# EAGLE design IAS_v006 (EAGLE 7.3.0)
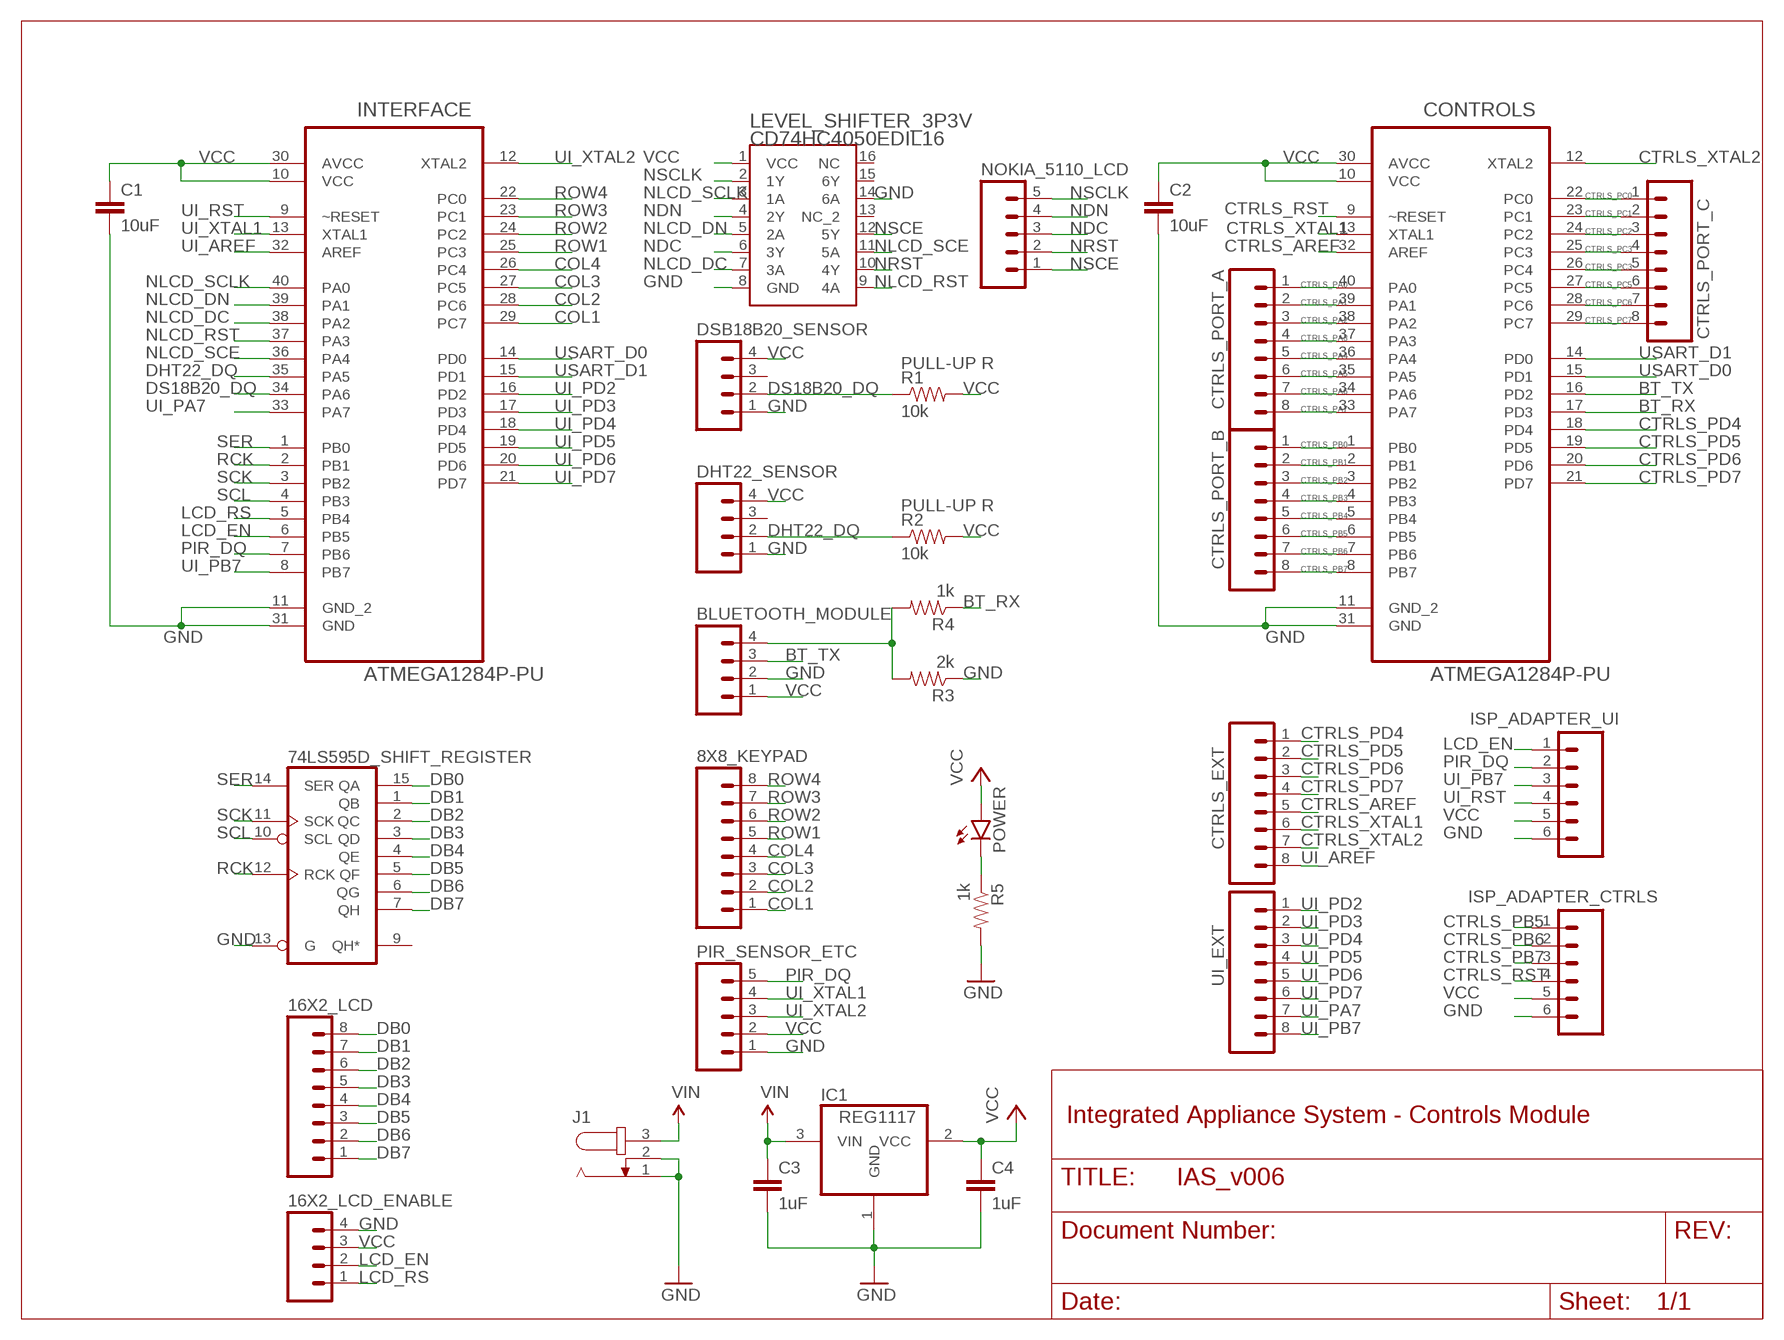
[diagram p0: schematic, sheet 1]

## Parts
8X8_KEYPAD  M08  [1X08_ROUND]
16X2_LCD  M08  [1X08_ROUND]
16X2_LCD_ENABLE  M04NO_SILK_ALL_ROUND  [1X04_NO_SILK_ALL_ROUND]
74LS595D_SHIFT_REGISTER  74LS595N  [DIL16]
BLUETOOTH_MODULE  M04NO_SILK_ALL_ROUND  [1X04_NO_SILK_ALL_ROUND]
C1  10uF  CAP1206  [1206]
C2  10uF  CAP1206  [1206]
C3  1uF  CAP1206  [1206]
C4  1uF  CAP1206  [1206]
CONTROLS  ATMEGA1284P-PU  [DIP254P1524X483-40]
CTRLS_EXT  M08  [1X08_ROUND]
CTRLS_PORT_A  M08  [1X08_ROUND]
CTRLS_PORT_B  M08  [1X08_ROUND]
CTRLS_PORT_C  M08  [1X08_ROUND]
DHT22_SENSOR  M04NO_SILK_ALL_ROUND  [1X04_NO_SILK_ALL_ROUND]
DSB18B20_SENSOR  M04NO_SILK_ALL_ROUND  [1X04_NO_SILK_ALL_ROUND]
IC1  REG1117  [SOT223]
INTERFACE  ATMEGA1284P-PU  [DIP254P1524X483-40]
ISP_ADAPTER_CTRLS  M06SILK_FEMALE_PTH  [1X06]
ISP_ADAPTER_UI  M06SILK_FEMALE_PTH  [1X06]
J1  JACK-PLUG0  [SPC4077]
LEVEL_SHIFTER_3P3V  CD74HC4050EDIL16  [DIL16]
NOKIA_5110_LCD  M05PTH  [1X05]
PIR_SENSOR_ETC  M05PTH  [1X05]
POWER  LED3MM  [LED3MM]
R1  10k  RESISTOR1206  [1206]
R2  10k  RESISTOR1206  [1206]
R3  2k  RESISTOR1206  [1206]
R4  1k  RESISTOR1206  [1206]
R5  1k  RESISTOR1206  [1206]
UI_EXT  M08  [1X08_ROUND]

## Nets
BT_RX: CONTROLS.17(PD3) R4.1
BT_TX: BLUETOOTH_MODULE.3 CONTROLS.16(PD2)
COL1: 8X8_KEYPAD.1 INTERFACE.29(PC7)
COL2: 8X8_KEYPAD.2 INTERFACE.28(PC6)
COL3: 8X8_KEYPAD.3 INTERFACE.27(PC5)
COL4: 8X8_KEYPAD.4 INTERFACE.26(PC4)
CTRLS_AREF: CONTROLS.32(AREF) CTRLS_EXT.5
CTRLS_PA0: CONTROLS.40(PA0) CTRLS_PORT_A.1
CTRLS_PA1: CONTROLS.39(PA1) CTRLS_PORT_A.2
CTRLS_PA2: CONTROLS.38(PA2) CTRLS_PORT_A.3
CTRLS_PA3: CONTROLS.37(PA3) CTRLS_PORT_A.4
CTRLS_PA4: CONTROLS.36(PA4) CTRLS_PORT_A.5
CTRLS_PA5: CONTROLS.35(PA5) CTRLS_PORT_A.6
CTRLS_PA6: CONTROLS.34(PA6) CTRLS_PORT_A.7
CTRLS_PA7: CONTROLS.33(PA7) CTRLS_PORT_A.8
CTRLS_PB0: CONTROLS.1(PB0) CTRLS_PORT_B.1
CTRLS_PB1: CONTROLS.2(PB1) CTRLS_PORT_B.2
CTRLS_PB2: CONTROLS.3(PB2) CTRLS_PORT_B.3
CTRLS_PB3: CONTROLS.4(PB3) CTRLS_PORT_B.4
CTRLS_PB4: CONTROLS.5(PB4) CTRLS_PORT_B.5
CTRLS_PB5: CONTROLS.6(PB5) CTRLS_PORT_B.6 ISP_ADAPTER_CTRLS.1
CTRLS_PB6: CONTROLS.7(PB6) CTRLS_PORT_B.7 ISP_ADAPTER_CTRLS.2
CTRLS_PB7: CONTROLS.8(PB7) CTRLS_PORT_B.8 ISP_ADAPTER_CTRLS.3
CTRLS_PC0: CONTROLS.22(PC0) CTRLS_PORT_C.1
CTRLS_PC1: CONTROLS.23(PC1) CTRLS_PORT_C.2
CTRLS_PC2: CONTROLS.24(PC2) CTRLS_PORT_C.3
CTRLS_PC3: CONTROLS.25(PC3) CTRLS_PORT_C.4
CTRLS_PC4: CONTROLS.26(PC4) CTRLS_PORT_C.5
CTRLS_PC5: CONTROLS.27(PC5) CTRLS_PORT_C.6
CTRLS_PC6: CONTROLS.28(PC6) CTRLS_PORT_C.7
CTRLS_PC7: CONTROLS.29(PC7) CTRLS_PORT_C.8
CTRLS_PD4: CONTROLS.18(PD4) CTRLS_EXT.1
CTRLS_PD5: CONTROLS.19(PD5) CTRLS_EXT.2
CTRLS_PD6: CONTROLS.20(PD6) CTRLS_EXT.3
CTRLS_PD7: CONTROLS.21(PD7) CTRLS_EXT.4
CTRLS_RST: CONTROLS.9(~RESET) ISP_ADAPTER_CTRLS.4
CTRLS_XTAL1: CONTROLS.13(XTAL1) CTRLS_EXT.6
CTRLS_XTAL2: CONTROLS.12(XTAL2) CTRLS_EXT.7
DB0: 16X2_LCD.8 74LS595D_SHIFT_REGISTER.15(QA)
DB1: 16X2_LCD.7 74LS595D_SHIFT_REGISTER.1(QB)
DB2: 16X2_LCD.6 74LS595D_SHIFT_REGISTER.2(QC)
DB3: 16X2_LCD.5 74LS595D_SHIFT_REGISTER.3(QD)
DB4: 16X2_LCD.4 74LS595D_SHIFT_REGISTER.4(QE)
DB5: 16X2_LCD.3 74LS595D_SHIFT_REGISTER.5(QF)
DB6: 16X2_LCD.2 74LS595D_SHIFT_REGISTER.6(QG)
DB7: 16X2_LCD.1 74LS595D_SHIFT_REGISTER.7(QH)
DHT22_DQ: DHT22_SENSOR.2 INTERFACE.35(PA5) R2.1
DS18B20_DQ: DSB18B20_SENSOR.2 INTERFACE.34(PA6) R1.1
GND: 16X2_LCD_ENABLE.4 74LS595D_SHIFT_REGISTER.13(G) BLUETOOTH_MODULE.2 C1.2 C2.2 C3.2 C4.2 CONTROLS.11(GND_2) CONTROLS.31(GND) DHT22_SENSOR.1 DSB18B20_SENSOR.1 IC1.1(GND) INTERFACE.11(GND_2) INTERFACE.31(GND) ISP_ADAPTER_CTRLS.6 ISP_ADAPTER_UI.6 J1.1 J1.2 LEVEL_SHIFTER_3P3V.8(GND) LEVEL_SHIFTER_3P3V.14(6A) PIR_SENSOR_ETC.1 R3.1 R5.2
LCD_EN: 16X2_LCD_ENABLE.2 INTERFACE.6(PB5) ISP_ADAPTER_UI.1
LCD_RS: 16X2_LCD_ENABLE.1 INTERFACE.5(PB4)
N$2: POWER.K(C) R5.1
N$7: BLUETOOTH_MODULE.4 R3.2 R4.2
NDC: LEVEL_SHIFTER_3P3V.6(3Y) NOKIA_5110_LCD.3
NDN: LEVEL_SHIFTER_3P3V.4(2Y) NOKIA_5110_LCD.4
NLCD_DC: INTERFACE.38(PA2) LEVEL_SHIFTER_3P3V.7(3A)
NLCD_DN: INTERFACE.39(PA1) LEVEL_SHIFTER_3P3V.5(2A)
NLCD_RST: INTERFACE.37(PA3) LEVEL_SHIFTER_3P3V.9(4A)
NLCD_SCE: INTERFACE.36(PA4) LEVEL_SHIFTER_3P3V.11(5A)
NLCD_SCLK: INTERFACE.40(PA0) LEVEL_SHIFTER_3P3V.3(1A)
NRST: LEVEL_SHIFTER_3P3V.10(4Y) NOKIA_5110_LCD.2
NSCE: LEVEL_SHIFTER_3P3V.12(5Y) NOKIA_5110_LCD.1
NSCLK: LEVEL_SHIFTER_3P3V.2(1Y) NOKIA_5110_LCD.5
PIR_DQ: INTERFACE.7(PB6) ISP_ADAPTER_UI.2 PIR_SENSOR_ETC.5
RCK: 74LS595D_SHIFT_REGISTER.12(RCK) INTERFACE.2(PB1)
ROW1: 8X8_KEYPAD.5 INTERFACE.25(PC3)
ROW2: 8X8_KEYPAD.6 INTERFACE.24(PC2)
ROW3: 8X8_KEYPAD.7 INTERFACE.23(PC1)
ROW4: 8X8_KEYPAD.8 INTERFACE.22(PC0)
SCK: 74LS595D_SHIFT_REGISTER.11(SCK) INTERFACE.3(PB2)
SCL: 74LS595D_SHIFT_REGISTER.10(SCL) INTERFACE.4(PB3)
SER: 74LS595D_SHIFT_REGISTER.14(SER) INTERFACE.1(PB0)
UI_AREF: CTRLS_EXT.8 INTERFACE.32(AREF)
UI_PA7: INTERFACE.33(PA7) UI_EXT.7
UI_PB7: INTERFACE.8(PB7) ISP_ADAPTER_UI.3 UI_EXT.8
UI_PD2: INTERFACE.16(PD2) UI_EXT.1
UI_PD3: INTERFACE.17(PD3) UI_EXT.2
UI_PD4: INTERFACE.18(PD4) UI_EXT.3
UI_PD5: INTERFACE.19(PD5) UI_EXT.4
UI_PD6: INTERFACE.20(PD6) UI_EXT.5
UI_PD7: INTERFACE.21(PD7) UI_EXT.6
UI_RST: INTERFACE.9(~RESET) ISP_ADAPTER_UI.4
UI_XTAL1: INTERFACE.13(XTAL1) PIR_SENSOR_ETC.4
UI_XTAL2: INTERFACE.12(XTAL2) PIR_SENSOR_ETC.3
USART_D0: CONTROLS.15(PD1) INTERFACE.14(PD0)
USART_D1: CONTROLS.14(PD0) INTERFACE.15(PD1)
VCC: 16X2_LCD_ENABLE.3 BLUETOOTH_MODULE.1 C1.1 C2.1 C4.1 CONTROLS.10(VCC) CONTROLS.30(AVCC) DHT22_SENSOR.4 DSB18B20_SENSOR.4 IC1.2(VCC) INTERFACE.10(VCC) INTERFACE.30(AVCC) ISP_ADAPTER_CTRLS.5 ISP_ADAPTER_UI.5 LEVEL_SHIFTER_3P3V.1(VCC) PIR_SENSOR_ETC.2 POWER.A R1.2 R2.2
VIN: C3.1 IC1.3(VIN) J1.3
Unconnected: 74LS595D_SHIFT_REGISTER.9(QH*) DHT22_SENSOR.3 DSB18B20_SENSOR.3 LEVEL_SHIFTER_3P3V.13(NC_2) LEVEL_SHIFTER_3P3V.15(6Y) LEVEL_SHIFTER_3P3V.16(NC)

## Notes on the sheet
- PULL-UP R
- PULL-UP R
- Integrated Appliance System - Controls Module

## Power pins joined to a net without a drawn wire
GND: 74LS595D_SHIFT_REGISTER.8(GND)
VCC: 74LS595D_SHIFT_REGISTER.16(VCC)

## Library data of the parts
8X8_KEYPAD 16X2_LCD CTRLS_EXT CTRLS_PORT_A CTRLS_PORT_B CTRLS_PORT_C UI_EXT = SparkFun-Connectors:M08: Header 8 Standard 8-pin 0.1" header. Use with straight break away headers (SKU : PRT-00116), right angle break away headers (PRT-00553), swiss pins (PRT-00743), machine pins (PRT-00117), and female headers (PRT-00115).; OC_NEWARK: unknown
16X2_LCD_ENABLE BLUETOOTH_MODULE DHT22_SENSOR DSB18B20_SENSOR = SparkFun-Connectors:M04: Header 4 Standard 4-pin 0.1" header. Use with straight break away headers (SKU : PRT-00116), right angle break away headers (PRT-00553), swiss pins (PRT-00743), machine pins (PRT-00117), and female headers (PRT-00115). Molex polarized connector foot print use with SKU : PRT-08231 with associated crimp pins and housings. 1MM SMD Version SKU: PRT-10208; OC_NEWARK: unknown
74LS595D_SHIFT_REGISTER = 74xx-us:74*595: 8-bit SHIFT REGISTER, output latch; MPN: SN74LS595D; OC_NEWARK: 34R8835
C1-C4 = SparkFun-Capacitors:CAP: Capacitor Standard 0603 ceramic capacitor, and 0.1" leaded capacitor.; OC_NEWARK: unknown
CONTROLS INTERFACE = Atmel_By_element14_Batch_1-00:ATMEGA1284P-PU: 8-bit Microcontroller with In-System Programmable Flash; MPN: ATMEGA1284P-PU; OC_FARNELL: 1715481; OC_NEWARK: 15R0264; PACKAGE: PDIP-40; SUPPLIER: Atmel
IC1 = sergio:REG1117: 800mA and 1A Low Dropout (LDO) Positive Regulator 1.8V, 2.5V, 2.85V, 3.3V, 5V, and Adj; MPN: REG1117; OC_FARNELL: 1097566; OC_NEWARK: 14P6981
ISP_ADAPTER_CTRLS ISP_ADAPTER_UI = SparkFun-Connectors:M06: Header 6 Standard 6-pin 0.1" header. Use with straight break away headers (SKU : PRT-00116), right angle break away headers (PRT-00553), swiss pins (PRT-00743), machine pins (PRT-00117), and female headers (PRT-00115). Molex polarized connector foot print use with SKU : PRT-08094 with associated crimp pins and housings. NOTES ON THE VARIANTS LOCK and LOCK_LONGPADS... This footprint was designed to help hold the alignment of a through-hole component (i.e. 6-pin header) while soldering it into place. You may notice that each hole has been shifted either up or down by 0.005 of an inch from it's more standard position (which is a perfectly straight line). This slight alteration caused the pins (the squares in the middle) to touch the edges of the holes. Because they are alternating, it causes a "brace" to hold the component in place. 0.005 has proven to be the perfect amount of "off-center" position when using our standard breakaway headers. Although looks a little odd when you look at the bare footprint, once you have a header in there, the alteration is very hard to notice. Also,if you push a header all the way into place, it is covered up entirely on the bottom side. This idea of altering the position of holes to aid alignment will be further integrated into the Sparkfun Library for other footprints. It can help hold any component with 3 or more connection pins.; OC_NEWARK: unknown; PROD_ID: CONN-08437
J1 = con-jack:JACK-PLUG: DC POWER JACK Power Jack, DC, Right Angle, Through Hole, Rated 5A at 16VDC, PC Terminals Distributor: Farnell (www.Farnell.de) Drawing: 84N1161.pdf / 84N1162.pdf Manufacturer: SPC Technology (www.spctechnology.com) Type: SPC4077 / SPC 4078; OC_FARNELL: unknown; OC_NEWARK: unknown
LEVEL_SHIFTER_3P3V = IAS:CD74HC4050E: Non-inverting hex buffer.; COPYRIGHT: Copyright (C) 2015 Accelerated Designs. All rights reserved; FAMILY: Buffer and Line Driver; MANUFACTURER_NAME: Texas Instruments; MANUFACTURER_PART_NUMBER: CD74HC4050EE4; RSPARTNUMBER: 7092573; SECTION: Standard and Speciality Logic; VENDOR: Texas Instruments
NOKIA_5110_LCD PIR_SENSOR_ETC = SparkFun-Connectors:M05: Header 5 Standard 5-pin 0.1" header. Use with straight break away headers (SKU : PRT-00116), right angle break away headers (PRT-00553), swiss pins (PRT-00743), machine pins (PRT-00117), and female headers (PRT-00115). Molex polarized connector foot print use with SKU : PRT-08230 with associated crimp pins and housings.; OC_NEWARK: unknown
POWER = SparkFun-LED:LED: LEDs Standard schematic elements and footprints for 5mm, 3mm, 1206, and 0603 sized LEDs. 5mm - Spark Fun Electronics SKU : COM-00529 (and others)
R1-R5 = SparkFun-Resistors:RESISTOR: Resistor Basic schematic elements and footprints for 0603, 1206, and PTH resistors.; OC_NEWARK: unknown

## Board
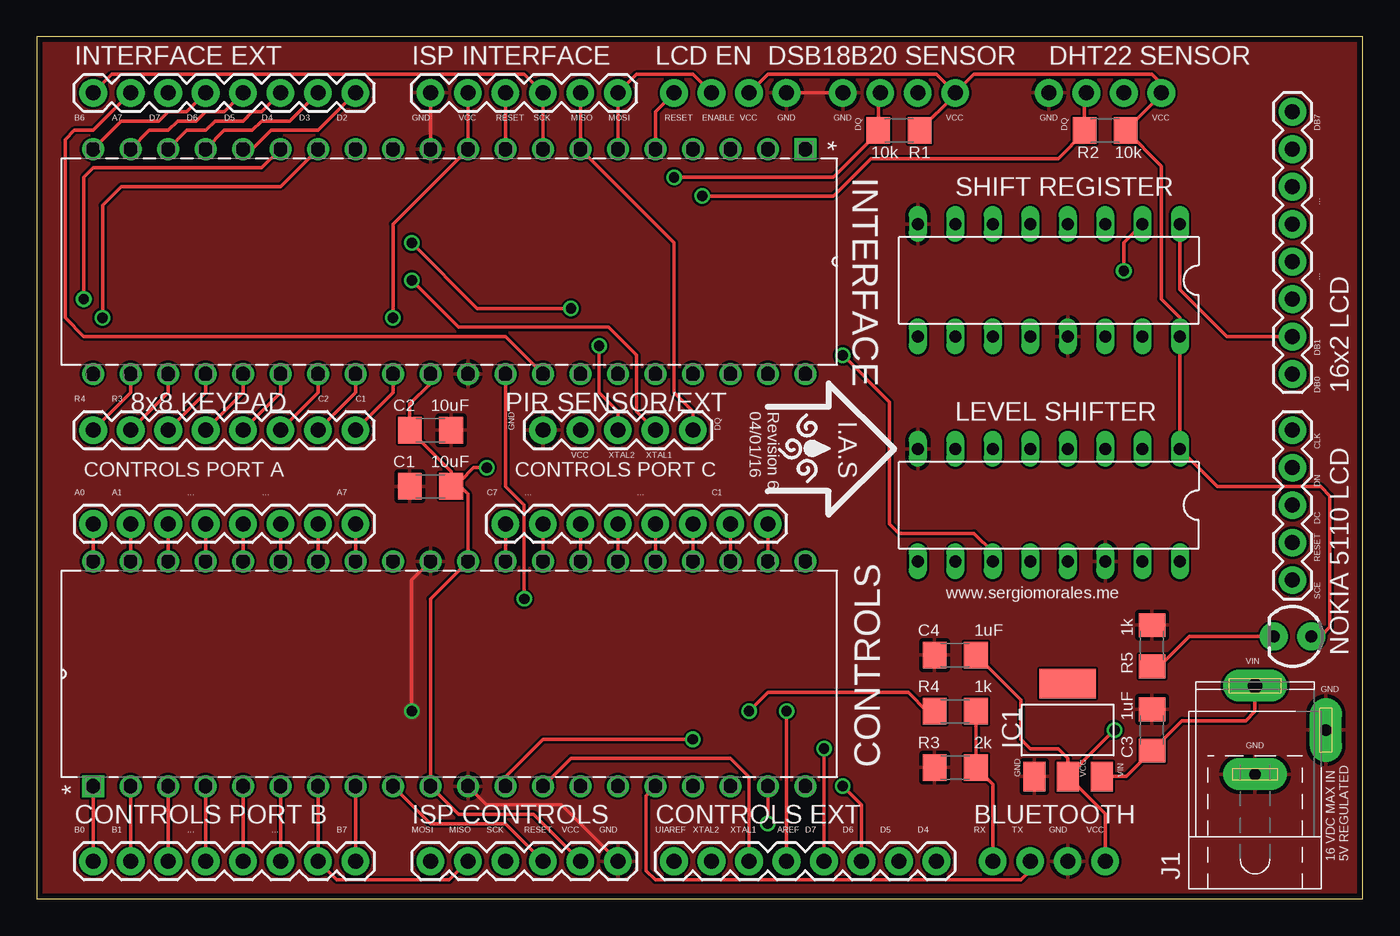
[diagram p1: board, top side]
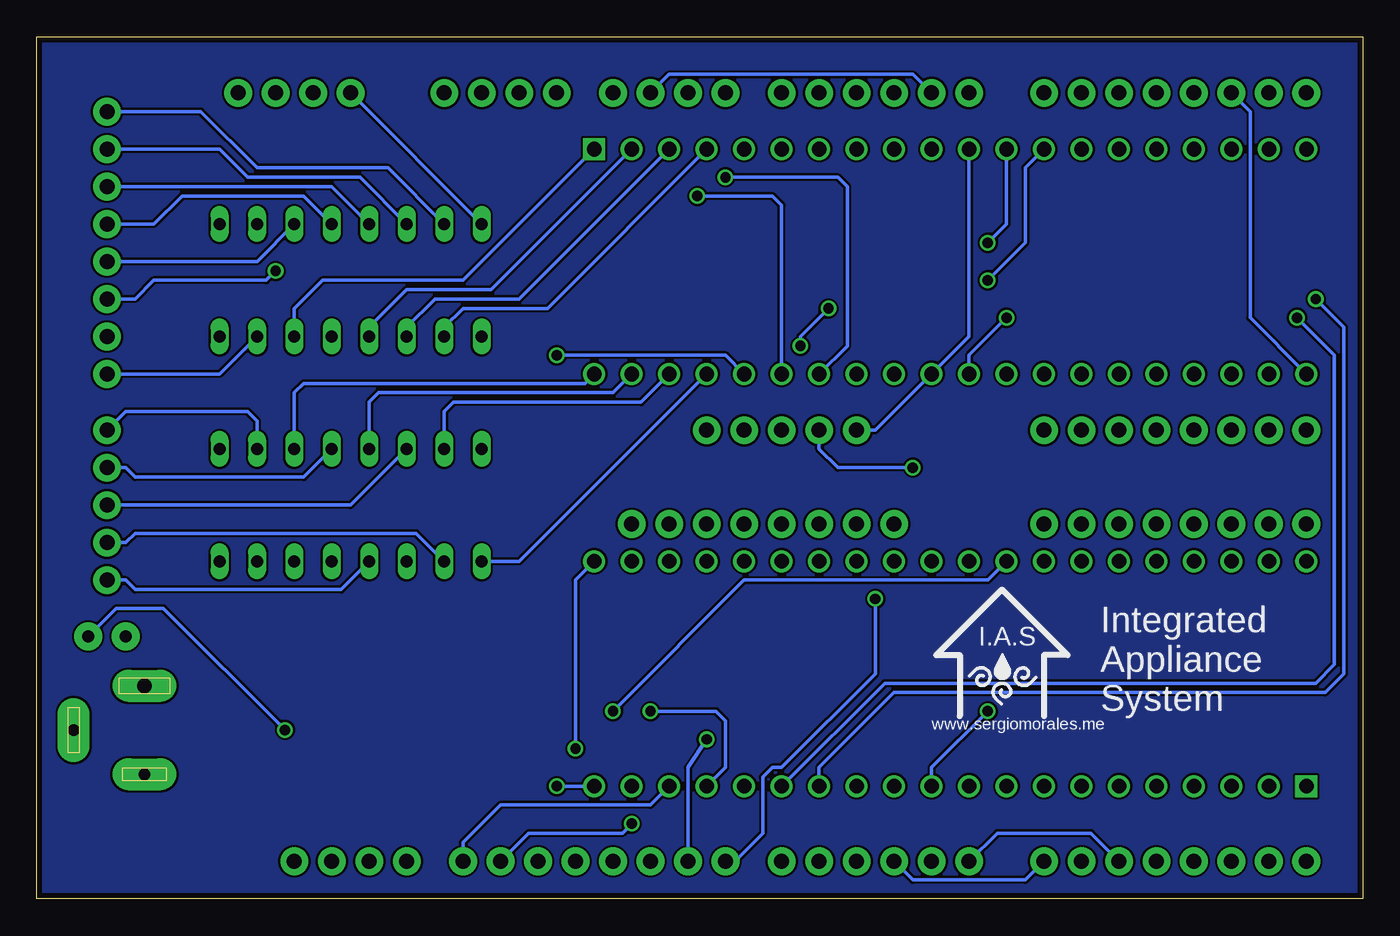
[diagram p2: board, bottom side, seen from below]

Size 89.84 x 58.41 mm. Coordinates in mm from the lower left corner, seen from the top.
Outline: 0,0 89.84,0 89.84,58.41 0,58.41 0,0
Copper layers (1*16): Top 0.0356mm / dielectric 1.5011mm / Bottom 0.0356mm
Design rules "LaenPCBOrder": minimum track width 6mil, minimum drill 13mil, track to track 6mil, track to pad 6mil, pad to pad 6mil, via to via 6mil, smd to smd 6mil, copper to edge 15mil, drill to drill 6mil, minimum pad ring 7mil, minimum via ring 7mil, stop-mask expansion 3mil, vias tented up to drill 0mil, thermal gap 10mil

### Footprints (pad centres in the part's own frame; a part is rotated, then mirrored left to right if it is on the bottom)
1X08_ROUND = drill 1.016 pad 1.88: 1 0,0; 2 2.54,0; 3 5.08,0; 4 7.62,0; 5 10.16,0; 6 12.7,0; 7 15.24,0; 8 17.78,0
1X04_NO_SILK_ALL_ROUND = drill 1.016 pad 1.88: 1 0,0; 2 2.54,0; 3 5.08,0; 4 7.62,0
DIL16 = drill 0.813 long: 1 -8.89,-3.81; 2 -6.35,-3.81; 3 -3.81,-3.81; 4 -1.27,-3.81; 5 1.27,-3.81; 6 3.81,-3.81; 7 6.35,-3.81; 8 8.89,-3.81; 9 8.89,3.81; 10 6.35,3.81; 11 3.81,3.81; 12 1.27,3.81; 13 -1.27,3.81; 14 -3.81,3.81; 15 -6.35,3.81; 16 -8.89,3.81
1206 = smd 1.6 x 1.8: 1 -1.4,0; 2 1.4,0
DIP254P1524X483-40 = drill 0.991 square: 1 -15.24,48.26 | drill 0.991: 2 -15.24,45.72; 3 -15.24,43.18; 4 -15.24,40.64; 5 -15.24,38.1; 6 -15.24,35.56; 7 -15.24,33.02; 8 -15.24,30.48; 9 -15.24,27.94; 10 -15.24,25.4; 11 -15.24,22.86; 12 -15.24,20.32; 13 -15.24,17.78; 14 -15.24,15.24; 15 -15.24,12.7; 16 -15.24,10.16; 17 -15.24,7.62; 18 -15.24,5.08; 19 -15.24,2.54; 20 -15.24,0; 21 0,0; 22 0,2.54; 23 0,5.08; 24 0,7.62; 25 0,10.16; 26 0,12.7; 27 0,15.24; 28 0,17.78; 29 0,20.32; 30 0,22.86; 31 0,25.4; 32 0,27.94; 33 0,30.48; 34 0,33.02; 35 0,35.56; 36 0,38.1; 37 0,40.64; 38 0,43.18; 39 0,45.72; 40 0,48.26
SOT223 = smd 1.499 x 2.007: 1 -2.261,-3.15; 2 0.025,-3.15; 3 2.311,-3.15 | smd 3.81 x 2.007: 4 0,3.15
1X06 = drill 1.016 pad 1.88: 1 0,0; 2 2.54,0; 3 5.08,0; 4 7.62,0; 5 10.16,0; 6 12.7,0
SPC4077 = drill 0.8 pad 2.184 long: 1 -3,0; 2 0,-4.8 | drill 1 pad 2.184 long: 3 3,0
1X05 = drill 1.016 pad 1.88: 1 0,0; 2 2.54,0; 3 5.08,0; 4 7.62,0; 5 10.16,0
LED3MM = drill 0.813 pad 1.88: A -1.27,0; K 1.27,0

### Placement (x,y rotation side)
8X8_KEYPAD  21.59,31.75 180 top
16X2_LCD  85.09,53.34 270 top
16X2_LCD_ENABLE  43.18,54.61 0 top
74LS595D_SHIFT_REGISTER  68.58,41.91 180 top
BLUETOOTH_MODULE  72.39,2.54 180 top
C1  26.67,27.94 180 top
C2  26.67,31.75 0 top
C3  75.56,11.43 90 top
C4  62.23,16.51 180 top
CONTROLS  52.07,22.86 90 top
CTRLS_EXT  60.96,2.54 180 top
CTRLS_PORT_A  3.81,25.4 0 top
CTRLS_PORT_B  3.81,2.54 0 top
CTRLS_PORT_C  49.53,25.4 180 top
DHT22_SENSOR  68.58,54.61 0 top
DSB18B20_SENSOR  54.61,54.61 0 top
IC1  69.85,11.43 0 top
INTERFACE  3.81,35.56 270 top
ISP_ADAPTER_CTRLS  26.67,2.54 0 top
ISP_ADAPTER_UI  39.37,54.61 180 top
J1  82.55,11.43 90 top
LEVEL_SHIFTER_3P3V  68.58,26.67 180 top
NOKIA_5110_LCD  85.09,21.59 90 top
PIR_SENSOR_ETC  34.29,31.75 0 top
POWER  85.09,17.78 180 top
R1  58.42,52.07 0 top
R2  72.39,52.07 0 top
R3  62.23,8.89 0 top
R4  62.23,12.7 0 top
R5  75.56,17.14 90 top
UI_EXT  21.59,54.61 180 top

### Tracks (layer width: path | path; a pad name or v marks a point on that pad's centre or on a via)
BT_RX  (via drill 0.7)
  Top 0.254: v48.26,12.7 49.53,13.97 59.05,13.97 60.33,12.7 R4.1
  Bottom 0.254: CONTROLS.17 43.18,8.89 43.18,12.06 43.81,12.7 v48.26,12.7
BT_TX
  Top 0.254: CONTROLS.16 41.27,6.99 41.27,1.91 41.91,1.27 66.67,1.27 67.31,1.91 BLUETOOTH_MODULE.3
COL1
  Top 0.254: 8X8_KEYPAD.1 24.13,34.29 INTERFACE.29
COL2
  Top 0.254: 8X8_KEYPAD.2 21.59,34.29 INTERFACE.28
COL3
  Top 0.254: 8X8_KEYPAD.3 19.05,34.29 INTERFACE.27
COL4
  Top 0.254: 8X8_KEYPAD.4 16.51,34.29 INTERFACE.26
CTRLS_AREF  (via drill 0.7)
  Top 0.254: CTRLS_EXT.5 v50.8,12.7
  Bottom 0.254: v50.8,12.7 41.91,21.59 25.4,21.59 CONTROLS.32
CTRLS_PA0
  Top 0.254: CTRLS_PORT_A.1 CONTROLS.40
CTRLS_PA1
  Top 0.254: CONTROLS.39 CTRLS_PORT_A.2
CTRLS_PA2
  Top 0.254: CTRLS_PORT_A.3 CONTROLS.38
CTRLS_PA3
  Top 0.254: CTRLS_PORT_A.4 CONTROLS.37
CTRLS_PA4
  Top 0.254: CTRLS_PORT_A.5 CONTROLS.36
CTRLS_PA5
  Top 0.254: CTRLS_PORT_A.6 CONTROLS.35
CTRLS_PA6
  Top 0.254: CTRLS_PORT_A.7 CONTROLS.34
CTRLS_PA7
  Top 0.254: CTRLS_PORT_A.8 CONTROLS.33
CTRLS_PB0
  Top 0.254: CTRLS_PORT_B.1 CONTROLS.1
CTRLS_PB1
  Top 0.254: CONTROLS.2 CTRLS_PORT_B.2
CTRLS_PB2
  Top 0.254: CONTROLS.3 CTRLS_PORT_B.3
CTRLS_PB3
  Top 0.254: CONTROLS.4 CTRLS_PORT_B.4
CTRLS_PB4
  Top 0.254: CONTROLS.5 CTRLS_PORT_B.5
CTRLS_PB5
  Top 0.254: CONTROLS.6 CTRLS_PORT_B.6
  Bottom 0.254: CTRLS_PORT_B.6 18.41,4.45 24.77,4.45 ISP_ADAPTER_CTRLS.1
CTRLS_PB6
  Top 0.254: CONTROLS.7 CTRLS_PORT_B.7 20.32,1.27 27.94,1.27 ISP_ADAPTER_CTRLS.2
CTRLS_PB7
  Top 0.254: CONTROLS.8 CTRLS_PORT_B.8
  Bottom 0.254: CTRLS_PORT_B.8 22.86,1.27 30.48,1.27 ISP_ADAPTER_CTRLS.3
CTRLS_PC0
  Top 0.254: CTRLS_PORT_C.1 CONTROLS.22
CTRLS_PC1
  Top 0.254: CTRLS_PORT_C.2 CONTROLS.23
CTRLS_PC2
  Top 0.254: CTRLS_PORT_C.3 CONTROLS.24
CTRLS_PC3
  Top 0.254: CTRLS_PORT_C.4 CONTROLS.25
CTRLS_PC4
  Top 0.254: CONTROLS.26 CTRLS_PORT_C.5
CTRLS_PC5
  Top 0.254: CTRLS_PORT_C.6 CONTROLS.27
CTRLS_PC6
  Top 0.254: CTRLS_PORT_C.7 CONTROLS.28
CTRLS_PC7
  Top 0.254: CTRLS_PORT_C.8 CONTROLS.29
CTRLS_PD4
  Bottom 0.254: CONTROLS.18 48.26,6.35 58.42,6.35 60.96,3.81 CTRLS_EXT.1
CTRLS_PD5  (via drill 0.7)
  Top 0.254: CONTROLS.19 v49.53,5.08
  Bottom 0.254: v49.53,5.08 50.16,4.45 56.52,4.45 CTRLS_EXT.2
CTRLS_PD6  (via drill 0.7)
  Top 0.254: v54.61,7.62 55.88,6.35 CTRLS_EXT.3
  Bottom 0.254: CONTROLS.20 v54.61,7.62
CTRLS_PD7  (via drill 0.7)
  Top 0.254: v53.34,10.16 CTRLS_EXT.4
  Bottom 0.254: CONTROLS.21 53.34,21.59 v53.34,10.16
CTRLS_RST
  Top 0.254: ISP_ADAPTER_CTRLS.4 31.75,5.08 26.67,5.08 CONTROLS.9
CTRLS_XTAL1
  Top 0.254: CONTROLS.13 36.2,9.53 46.99,9.53 48.26,8.26 CTRLS_EXT.6
CTRLS_XTAL2  (via drill 0.7)
  Top 0.254: v44.45,10.79 34.29,10.79 31.75,8.26 CONTROLS.12
  Bottom 0.254: v44.45,10.79 45.72,8.89 CTRLS_EXT.7
DB0
  Bottom 0.254: 74LS595D_SHIFT_REGISTER.15 77.47,35.56 16X2_LCD.8
DB1
  Top 0.254: 74LS595D_SHIFT_REGISTER.1 77.47,41.27 80.64,38.1 16X2_LCD.7
DB2  (via drill 0.7)
  Top 0.254: 74LS595D_SHIFT_REGISTER.2 73.66,44.45 v73.66,42.55
  Bottom 0.254: 16X2_LCD.6 83.19,40.64 81.92,41.91 74.3,41.91 v73.66,42.55
DB3
  Bottom 0.254: 74LS595D_SHIFT_REGISTER.3 74.93,43.18 16X2_LCD.5
DB4
  Bottom 0.254: 74LS595D_SHIFT_REGISTER.4 71.75,47.62 80.01,47.62 81.92,45.72 16X2_LCD.4
DB5
  Bottom 0.254: 74LS595D_SHIFT_REGISTER.5 69.85,48.26 16X2_LCD.3
DB6
  Bottom 0.254: 74LS595D_SHIFT_REGISTER.6 67.94,48.9 75.56,48.9 77.47,50.8 16X2_LCD.2
DB7
  Bottom 0.254: 74LS595D_SHIFT_REGISTER.7 66.04,49.53 74.93,49.53 78.74,53.34 16X2_LCD.1
DHT22_DQ  (via drill 0.7)
  Top 0.254: DHT22_SENSOR.2 70.99,54.48 R2.1 70.99,51.94 69.22,50.16 56.52,50.16 53.98,47.62 v45.09,47.62
  Bottom 0.254: INTERFACE.35 39.37,46.99 40.01,47.62 v45.09,47.62
DS18B20_DQ  (via drill 0.7)
  Top 0.254: DSB18B20_SENSOR.2 57.02,54.48 R1.1 57.02,51.94 53.98,48.9 v43.18,48.9
  Bottom 0.254: INTERFACE.34 34.92,37.47 34.92,48.26 35.56,48.9 v43.18,48.9
GND  (via drill 0.7)
  Top 0.254: ISP_ADAPTER_CTRLS.6 35.56,6.35 30.48,6.35 CONTROLS.11 | CONTROLS.31 25.4,21.59 v25.4,12.7 | ISP_ADAPTER_UI.6 INTERFACE.11 | DSB18B20_SENSOR.1 16X2_LCD_ENABLE.4
  Bottom 0.254: v25.4,12.7 29.21,8.89 CONTROLS.11 | INTERFACE.11 26.67,38.1 INTERFACE.31 33.02,31.75 PIR_SENSOR_ETC.1 | 74LS595D_SHIFT_REGISTER.8 DHT22_SENSOR.1
  pour Top: 0,0 0,58.42 90.17,58.42 90.17,0
LCD_EN
  Top 0.254: INTERFACE.6 ISP_ADAPTER_UI.1 40.64,55.88 44.45,55.88 16X2_LCD_ENABLE.2
LCD_RS
  Top 0.254: 16X2_LCD_ENABLE.1 41.91,53.34 INTERFACE.5
N$1
  pour Bottom: 0,0 0,58.42 90.17,58.42 90.17,0
N$2
  Top 0.254: POWER.K 78.11,17.78 76.07,15.74 R5.1
N$7
  Top 0.254: R4.2 R3.2 64.77,7.75 BLUETOOTH_MODULE.4
NDC
  Bottom 0.254: LEVEL_SHIFTER_3P3V.6 68.58,26.67 NOKIA_5110_LCD.3
NDN
  Bottom 0.254: LEVEL_SHIFTER_3P3V.4 71.75,28.57 83.19,28.57 83.82,29.21 NOKIA_5110_LCD.4
NLCD_DC
  Bottom 0.254: INTERFACE.38 48.9,33.66 61.59,33.66 62.23,33.02 LEVEL_SHIFTER_3P3V.7
NLCD_DN
  Bottom 0.254: INTERFACE.39 50.8,34.29 66.67,34.29 67.31,33.66 LEVEL_SHIFTER_3P3V.5
NLCD_RST
  Bottom 0.254: INTERFACE.37 57.15,22.86 LEVEL_SHIFTER_3P3V.9
NLCD_SCE  (via drill 0.7)
  Top 0.254: v54.61,36.83 57.78,33.66 57.78,25.4 58.42,24.77 63.5,24.77 64.77,23.5 LEVEL_SHIFTER_3P3V.11
  Bottom 0.254: INTERFACE.36 43.18,36.83 v54.61,36.83
NLCD_SCLK
  Bottom 0.254: INTERFACE.40 52.7,34.92 71.75,34.92 72.39,34.29 LEVEL_SHIFTER_3P3V.3
NRST
  Bottom 0.254: LEVEL_SHIFTER_3P3V.10 64.14,24.77 83.19,24.77 83.82,24.13 NOKIA_5110_LCD.2
NSCE
  Bottom 0.254: LEVEL_SHIFTER_3P3V.12 69.22,20.95 83.19,20.95 83.82,21.59 NOKIA_5110_LCD.1
NSCLK
  Bottom 0.254: LEVEL_SHIFTER_3P3V.2 74.93,32.38 75.56,33.02 83.82,33.02 NOKIA_5110_LCD.5
PIR_DQ
  Top 0.254: ISP_ADAPTER_UI.2 INTERFACE.7 43.18,44.45 43.18,34.29 44.45,33.02 PIR_SENSOR_ETC.5
RCK
  Bottom 0.254: INTERFACE.2 59.05,41.27 64.77,41.27 67.31,38.73 74LS595D_SHIFT_REGISTER.12
ROW1
  Top 0.254: 8X8_KEYPAD.5 13.97,34.29 INTERFACE.25
ROW2
  Top 0.254: 8X8_KEYPAD.6 11.43,34.29 INTERFACE.24
ROW3
  Top 0.254: 8X8_KEYPAD.7 8.89,34.29 INTERFACE.23
ROW4
  Top 0.254: 8X8_KEYPAD.8 6.35,34.29 INTERFACE.22
SCK
  Bottom 0.254: INTERFACE.3 57.15,40.64 62.87,40.64 64.77,38.73 74LS595D_SHIFT_REGISTER.11
SCL
  Bottom 0.254: INTERFACE.4 55.24,40.01 60.96,40.01 62.23,38.73 74LS595D_SHIFT_REGISTER.10
SER
  Bottom 0.254: INTERFACE.1 60.96,41.91 70.48,41.91 72.39,40.01 74LS595D_SHIFT_REGISTER.14
UI_AREF  (via drill 0.7)
  Top 0.254: INTERFACE.32 31.75,27.94 33.02,26.67 v33.02,20.32
  Bottom 0.254: v33.02,20.32 33.02,15.24 39.37,8.89 40.01,8.89 40.64,8.26 40.64,4.45 42.55,2.54 CTRLS_EXT.8
UI_PA7
  Top 0.254: UI_EXT.7 3.81,52.07 2.54,52.07 1.91,51.44 1.91,39.37 3.17,38.1 31.75,38.1 INTERFACE.33
UI_PB7
  Top 0.254: UI_EXT.8 5.08,55.88 33.02,55.88 ISP_ADAPTER_UI.3 INTERFACE.8
UI_PD2
  Top 0.254: UI_EXT.1 19.05,52.07 15.88,52.07 14.61,50.8 INTERFACE.16
UI_PD3
  Top 0.254: UI_EXT.2 17.14,52.7 15.24,52.7 14.61,52.07 12.7,52.07 INTERFACE.17
UI_PD4
  Top 0.254: UI_EXT.3 15.24,53.34 14.61,53.34 13.97,52.7 12.06,52.7 11.43,52.07 10.16,52.07 INTERFACE.18
UI_PD5
  Top 0.254: UI_EXT.4 12.7,53.34 11.43,53.34 10.79,52.7 9.53,52.7 8.89,52.07 7.62,52.07 INTERFACE.19
UI_PD6
  Top 0.254: UI_EXT.5 10.16,53.34 8.89,53.34 8.26,52.7 5.71,52.7 INTERFACE.20
UI_PD7
  Bottom 0.254: UI_EXT.6 7.62,53.34 7.62,39.37 INTERFACE.21
UI_RST
  Top 0.254: ISP_ADAPTER_UI.4 INTERFACE.9
UI_XTAL1  (via drill 0.7)
  Top 0.254: v25.4,41.91 28.57,38.73 38.73,38.73 40.64,36.83 40.64,33.02 PIR_SENSOR_ETC.4
  Bottom 0.254: INTERFACE.13 22.86,49.53 22.86,44.45 v25.4,41.91
UI_XTAL2  (via drill 0.7)
  Top 0.254: v25.4,44.45 29.84,40.01 v36.2,40.01 | v38.1,37.47 38.1,34.29 39.37,33.02 PIR_SENSOR_ETC.3
  Bottom 0.254: INTERFACE.12 24.13,45.72 v25.4,44.45 | v36.2,40.01 38.1,38.1 v38.1,37.47
USART_D0  (via drill 0.7)
  Top 0.254: INTERFACE.14 16.51,48.26 5.71,48.26 4.45,46.99 v4.45,39.37
  Bottom 0.254: v4.45,39.37 1.91,36.83 1.91,15.88 3.17,14.61 32.38,14.61 CONTROLS.15
USART_D1  (via drill 0.7)
  Top 0.254: INTERFACE.15 15.24,49.53 3.81,49.53 3.17,48.9 v3.17,40.64
  Bottom 0.254: v3.17,40.64 1.27,38.73 1.27,15.24 2.54,13.97 31.75,13.97 36.83,8.89 CONTROLS.14
VCC  (via drill 0.7)
  Top 0.254: ISP_ADAPTER_CTRLS.5 33.66,5.71 28.57,5.71 CONTROLS.10 26.67,20.32 CONTROLS.30 29.21,27.43 28.7,27.94 | ISP_ADAPTER_UI.5 INTERFACE.10 24.13,45.72 v24.13,39.37 | 16X2_LCD_ENABLE.3 49.53,55.88 60.96,55.88 DSB18B20_SENSOR.4 | 28.7,27.94 28.7,28.32 29.6,29.21 v30.48,29.21 | 28.7,27.94 C1.1 28.07,28.95 C2.1 25.27,33.52 26.67,34.92 INTERFACE.30 | DSB18B20_SENSOR.4 63.5,55.88 75.56,55.88 76.2,55.24 DHT22_SENSOR.4 76.2,54.48 R2.2 76.2,49.66 76.2,40.64 77.47,39.37 74LS595D_SHIFT_REGISTER.16 LEVEL_SHIFTER_3P3V.1 80.01,27.94 87,27.94 87.63,27.3 87.63,18.41 87,17.78 POWER.A | R1.2 62.23,54.48 DSB18B20_SENSOR.4 | C4.1 66.67,13.46 66.67,10.79 67.31,10.16 69.22,10.16 69.88,9.5 IC1.2 | IC1.2 72.39,5.77 BLUETOOTH_MODULE.1 | IC1.2 v73.03,11.43
  Bottom 0.254: v24.13,39.37 26.67,36.83 INTERFACE.30 | 16X2_LCD_ENABLE.3 46.99,55.88 30.48,55.88 ISP_ADAPTER_UI.5 | v30.48,29.21 35.56,29.21 36.83,30.48 PIR_SENSOR_ETC.2 | v73.03,11.43 81.28,19.68 84.45,19.68 POWER.A
VIN
  Top 0.254: IC1.3 73.81,8.28 C3.1 77.6,12.06 81.92,12.06 82.55,12.7 J1.3

### Text on the board
tPlace: I.A.S
bPlace: I.A.S | Integrated / Appliance / System
tNames: INTERFACE EXT | ISP INTERFACE | LCD EN | DSB18B20 SENSOR | DHT22 SENSOR | B6 | A7 | D7 | D6 | D5 | D4 | D3 | D2 | GND | VCC | RESET | SCK | MISO | MOSI | RESET | ENABLE | VCC | GND | GND | VCC | GND | VCC | DQ | DQ | DB7 | SHIFT REGISTER | ... | ... | DB1 | R4 | R3 | C2 | C1 | DB0 | 16x2 LCD | 8x8 KEYPAD | PIR SENSOR/EXT | Revision 6 / 04/01/16 | GND | DQ | LEVEL SHIFTER | VCC | XTAL2 | XTAL1 | CLK | CONTROLS PORT A | CONTROLS PORT C | DN | A0 | A1 | ... | ... | A7 | C7 | ... | ... | C1 | DC | RESET | www.sergiomorales.me | SCE | NOKIA 5110 LCD | VIN | GND | GND | GND | VCC | VIN | CONTROLS PORT B | ISP CONTROLS | CONTROLS EXT | BLUETOOTH | B0 | B1 | ... | ... | B7 | MOSI | MISO | SCK | RESET | VCC | GND | UIAREF | XTAL2 | XTAL1 | AREF | D7 | D6 | D5 | D4 | RX | TX | GND | VCC | 16 VDC MAX IN / 5V REGULATED
bNames: www.sergiomorales.me